# EAGLE schematic rf_front (EAGLE 9.6.2)
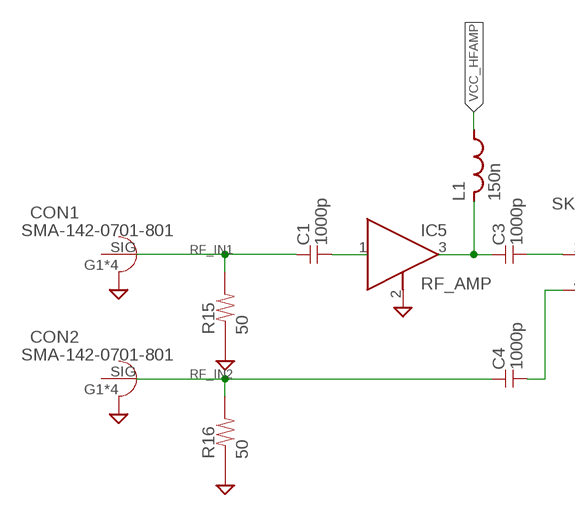
[diagram p0: schematic, sheet 1, part 1 of 2]
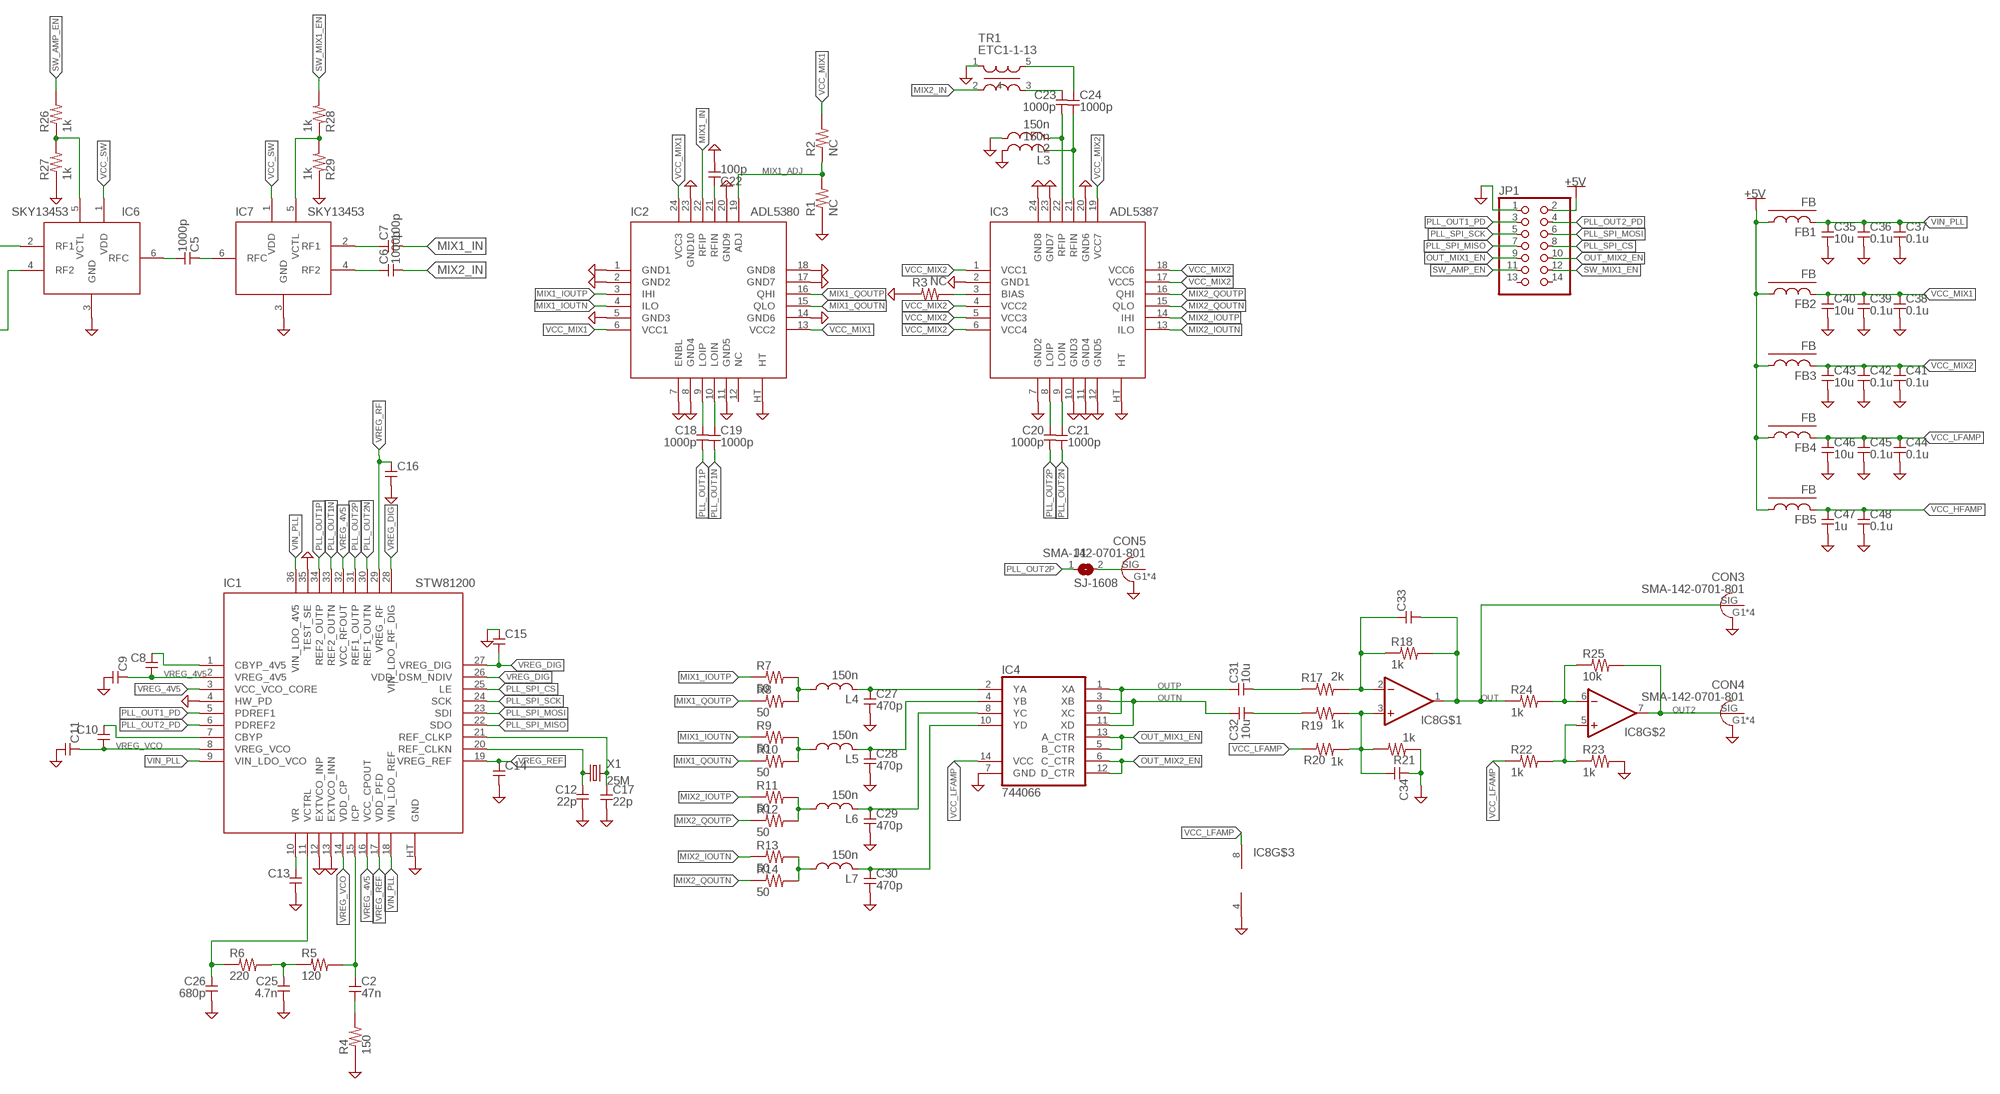
[diagram p1: schematic, sheet 1, part 2 of 2]

## Parts
C1  1000p  C-1608  [1608]
C2  47n  C-1608  [1608]
C3  1000p  C-1608  [1608]
C4  1000p  C-1608  [1608]
C5  1000p  C-1608  [1608]
C6  1000p  C-1608  [1608]
C7  100p  C-1608  [1608]
C8  C-1608  [1608]
C9  C-1608  [1608]
C10  C-1608  [1608]
C11  C-1608  [1608]
C12  22p  C-1608  [1608]
C13  C-1608  [1608]
C14  C-1608  [1608]
C15  C-1608  [1608]
C16  C-1608  [1608]
C17  22p  C-1608  [1608]
C18  1000p  C-1608  [1608]
C19  1000p  C-1608  [1608]
C20  1000p  C-1608  [1608]
C21  1000p  C-1608  [1608]
C22  100p  C-1608  [1608]
C23  1000p  C-1608  [1608]
C24  1000p  C-1608  [1608]
C25  4.7n  C-1608  [1608]
C26  680p  C-1608  [1608]
C27  470p  C-1608  [1608]
C28  470p  C-1608  [1608]
C29  470p  C-1608  [1608]
C30  470p  C-1608  [1608]
C31  10u  C-2012  [2012]
C32  10u  C-2012  [2012]
C33  C-1608  [1608]
C34  C-1608  [1608]
C35  10u  C-2012  [2012]
C36  0.1u  C-1608  [1608]
C37  0.1u  C-1608  [1608]
C38  0.1u  C-1608  [1608]
C39  0.1u  C-1608  [1608]
C40  10u  C-2012  [2012]
C41  0.1u  C-1608  [1608]
C42  0.1u  C-1608  [1608]
C43  10u  C-2012  [2012]
C44  0.1u  C-1608  [1608]
C45  0.1u  C-1608  [1608]
C46  10u  C-2012  [2012]
C47  1u  C-1608  [1608]
C48  0.1u  C-1608  [1608]
CON1  SMA-142-0701-801  [SMA-142-0701-801]
CON2  SMA-142-0701-801  [SMA-142-0701-801]
CON3  SMA-142-0701-801  [SMA-142-0701-801]
CON4  SMA-142-0701-801  [SMA-142-0701-801]
CON5  SMA-142-0701-801  [SMA-142-0701-801]
FB1  FB  [1608-J]
FB2  FB  [1608-J]
FB3  FB  [1608-J]
FB4  FB  [1608-J]
FB5  FB  [1608-J]
IC1  STW81200  [VFQFPN36]
IC2  ADL5380  [LFCSP24]
IC3  ADL5387  [LFCSP24]
IC4  744066  [SOP14]
IC5  RF_AMP  [SOT89]
IC6  SKY13453  [SKY13453]
IC7  SKY13453  [SKY13453]
IC8  OPA-2-SOP  [SOP8]
J1  SJ-1608  [1608-J]
JP1  PINHD-2X7  [2X07]
L1  150n  L-1608  [1608]
L2  150n  L-1608  [1608]
L3  150n  L-1608  [1608]
L4  150n  L-1608  [1608]
L5  150n  L-1608  [1608]
L6  150n  L-1608  [1608]
L7  150n  L-1608  [1608]
R1  NC  R-1608  [1608]
R2  NC  R-1608  [1608]
R3  NC  R-1608  [1608]
R4  150  R-1608  [1608]
R5  120  R-1608  [1608]
R6  220  R-1608  [1608]
R7  50  R-1608  [1608]
R8  50  R-1608  [1608]
R9  50  R-1608  [1608]
R10  50  R-1608  [1608]
R11  50  R-1608  [1608]
R12  50  R-1608  [1608]
R13  50  R-1608  [1608]
R14  50  R-1608  [1608]
R15  50  R-1608  [1608]
R16  50  R-1608  [1608]
R17  2k  R-1608  [1608]
R18  1k  R-1608  [1608]
R19  1k  R-1608  [1608]
R20  1k  R-1608  [1608]
R21  1k  R-1608  [1608]
R22  1k  R-1608  [1608]
R23  1k  R-1608  [1608]
R24  1k  R-1608  [1608]
R25  10k  R-1608  [1608]
R26  1k  R-1608  [1608]
R27  1k  R-1608  [1608]
R28  1k  R-1608  [1608]
R29  1k  R-1608  [1608]
TR1  ETC1-1-13  [ETC1-1-13]
X1  25M  CRYSTALHC49S  [HC49/S]

## Nets
+5V: FB1.1 FB2.1 FB3.1 FB4.1 FB5.1 JP1.2
GND: C9.2 C11.2 C12.2 C13.2 C14.2 C15.1 C16.2 C17.2 C22.2 C25.2 C26.2 C27.2 C28.2 C29.2 C30.2 C34.1 C35.2 C36.2 C37.2 C38.2 C39.2 C40.2 C41.2 C42.2 C43.2 C44.2 C45.2 C46.2 C47.2 C48.2 CON1.G1(GND) CON1.G2(GND) CON1.G3(GND) CON1.G4(GND) CON2.G1(GND) CON2.G2(GND) CON2.G3(GND) CON2.G4(GND) CON3.G1(GND) CON3.G2(GND) CON3.G3(GND) CON3.G4(GND) CON4.G1(GND) CON4.G2(GND) CON4.G3(GND) CON4.G4(GND) CON5.G1(GND) CON5.G2(GND) CON5.G3(GND) CON5.G4(GND) IC1.4(HW_PD) IC1.12(EXTVCO_INP) IC1.13(EXTVCO_INN) IC1.35(TEST_SE) IC1.HT(GND) IC2.1(GND1) IC2.2(GND2) IC2.5(GND3) IC2.7(ENBL) IC2.8(GND4) IC2.11(GND5) IC2.14(GND6) IC2.17(GND7) IC2.18(GND8) IC2.20(GND9) IC2.23(GND10) IC2.HT IC3.2(GND1) IC3.7(GND2) IC3.10(GND3) IC3.11(GND4) IC3.12(GND5) IC3.20(GND6) IC3.23(GND7) IC3.24(GND8) IC3.HT IC4.7(GND) IC5.2(GND) IC6.3(GND) IC7.3(GND) IC8.4(V-) JP1.1 L2.1 L3.1 R1.1 R3.1 R4.1 R15.1 R16.1 R21.1 R23.2 R27.1 R29.1 TR1.1
MIX1_ADJ: IC2.19(ADJ) R1.2 R2.1
MIX1_IN: C7.2 IC2.22(RFIP)
MIX1_IOUTN: IC2.4(ILO) R9.1
MIX1_IOUTP: IC2.3(IHI) R7.1
MIX1_QOUTN: IC2.15(QLO) R10.1
MIX1_QOUTP: IC2.16(QHI) R8.1
MIX2_IN: C6.2 TR1.2
MIX2_IOUTN: IC3.13(ILO) R13.1
MIX2_IOUTP: IC3.14(IHI) R11.1
MIX2_QOUTN: IC3.15(QLO) R14.1
MIX2_QOUTP: IC3.16(QHI) R12.1
N$1: C1.2 IC5.1(IN)
N$2: C2.2 R4.2
N$3: C2.1 IC1.15(ICP) R5.2
N$4: C3.1 IC5.3(OUT) L1.2
N$5: C25.1 R5.1 R6.2
N$6: C4.2 IC6.4(RF2)
N$7: C3.2 IC6.2(RF1)
N$8: C5.2 IC6.6(RFC)
N$9: C5.1 IC7.6(RFC)
N$10: C6.1 IC7.4(RF2)
N$11: C7.1 IC7.2(RF1)
N$12: C13.1 IC1.10(VR)
N$13: C8.1 IC1.1(CBYP_4V5)
N$14: C12.1 IC1.20(REF_CLKN) X1.1
N$15: C10.1 IC1.7(CBYP)
N$16: C17.1 IC1.21(REF_CLKP) X1.2
N$17: C18.1 IC2.9(LOIP)
N$18: C19.1 IC2.10(LOIN)
N$19: IC3.3(BIAS) R3.2
N$20: C22.1 IC2.21(RFIN)
N$21: C20.1 IC3.8(LOIP)
N$22: C21.1 IC3.9(LOIN)
N$23: C24.2 IC3.21(RFIN) L3.2
N$24: C23.2 IC3.22(RFIP) L2.2
N$25: C23.1 TR1.3
N$26: C24.1 TR1.5
N$27: C26.1 IC1.11(VCTRL) R6.1
N$28: C30.1 IC4.10(YD) L7.2
N$29: C29.1 IC4.8(YC) L6.2
N$30: C28.1 IC4.4(YB) L5.2
N$31: C27.1 IC4.2(YA) L4.2
N$32: L4.1 R7.2 R8.2
N$33: L5.1 R9.2 R10.2
N$34: L6.1 R11.2 R12.2
N$35: L7.1 R13.2 R14.2
N$36: C34.2 IC8.3(+IN) R19.2 R20.1 R21.2
N$37: C33.1 IC8.2(-IN) R17.2 R18.1
N$38: C31.2 R17.1
N$39: C32.2 R19.1
N$40: IC8.5(+IN) R22.2 R23.1
N$41: CON5.SIG J1.2
N$42: IC8.6(-IN) R24.2 R25.1
N$46: IC6.5(VCTL) R26.1 R27.2
N$49: IC7.5(VCTL) R28.1 R29.2
OUT: C33.2 CON3.SIG IC8.1(OUT) R18.2 R24.1
OUT2: CON4.SIG IC8.7(OUT) R25.2
OUT_MIX1_EN: IC4.5(B_CTR) IC4.13(A_CTR) JP1.9
OUT_MIX2_EN: IC4.6(C_CTR) IC4.12(D_CTR) JP1.10
OUTN: C32.1 IC4.3(XB) IC4.11(XD)
OUTP: C31.1 IC4.1(XA) IC4.9(XC)
PLL_OUT1_PD: IC1.5(PDREF1) JP1.3
PLL_OUT1N: C19.2 IC1.33(REF2_OUTN)
PLL_OUT1P: C18.2 IC1.34(REF2_OUTP)
PLL_OUT2_PD: IC1.6(PDREF2) JP1.4
PLL_OUT2N: C21.2 IC1.30(REF1_OUTN)
PLL_OUT2P: C20.2 IC1.31(REF1_OUTP) J1.1
PLL_SPI_CS: IC1.25(LE) JP1.8
PLL_SPI_MISO: IC1.22(SDO) JP1.7
PLL_SPI_MOSI: IC1.23(SDI) JP1.6
PLL_SPI_SCK: IC1.24(SCK) JP1.5
RF_IN1: C1.1 CON1.SIG R15.2
RF_IN2: C4.1 CON2.SIG R16.2
SW_AMP_EN: JP1.11 R26.2
SW_MIX1_EN: JP1.12 R28.2
VCC_HFAMP: C47.1 C48.1 FB5.2 L1.1
VCC_LFAMP: C44.1 C45.1 C46.1 FB4.2 IC4.14(VCC) IC8.8(V+) R20.2 R22.1
VCC_MIX1: C38.1 C39.1 C40.1 FB2.2 IC2.6(VCC1) IC2.13(VCC2) IC2.24(VCC3) R2.2
VCC_MIX2: C41.1 C42.1 C43.1 FB3.2 IC3.1(VCC1) IC3.4(VCC2) IC3.5(VCC3) IC3.6(VCC4) IC3.17(VCC5) IC3.18(VCC6) IC3.19(VCC7)
VCC_SW: IC6.1(VDD) IC7.1(VDD)
VIN_PLL: C35.1 C36.1 C37.1 FB1.2 IC1.9(VIN_LDO_VCO) IC1.18(VIN_LDO_REF) IC1.36(VIN_LDO_4V5)
VREG_4V5: C8.2 C9.1 IC1.2(VREG_4V5) IC1.3(VCC_VCO_CORE) IC1.16(VCC_CPOUT) IC1.32(VCC_RFOUT)
VREG_DIG: C15.2 IC1.26(VDD_DSM_NDIV) IC1.27(VREG_DIG) IC1.28(VIN_LDO_RF_DIG)
VREG_REF: C14.1 IC1.17(VDD_PFD) IC1.19(VREG_REF)
VREG_RF: C16.1 IC1.29(VREG_RF)
VREG_VCO: C10.2 C11.1 IC1.8(VREG_VCO) IC1.14(VDD_CP)
Unconnected: IC2.12(NC) JP1.13 JP1.14 TR1.4

## Library data of the parts
C1-C48 = my_rcl:C
CON1-CON5 = my_connector:SMA
FB1-FB5 = my_rcl:FB
IC1 = my_ic:STW81200
IC2 = my_ic:ADL5380
IC3 = my_ic:ADL5387
IC4 = my_ic:744066
IC5 = my_ic:RF_AMP
IC6 IC7 = my_ic:SKY13453
IC8 = my_ic:OPA-2
J1 = my_rcl:SJ
JP1 = pinhead:PINHD-2X7: PIN HEADER
L1-L7 = my_rcl:L
R1-R29 = my_rcl:R
TR1 = my_rcl:ETC1-1-13
X1 = my_rcl:CRYSTAL: CRYSTAL